# Altium schematic sheet Auxillary_Supply.SchDoc
size A3
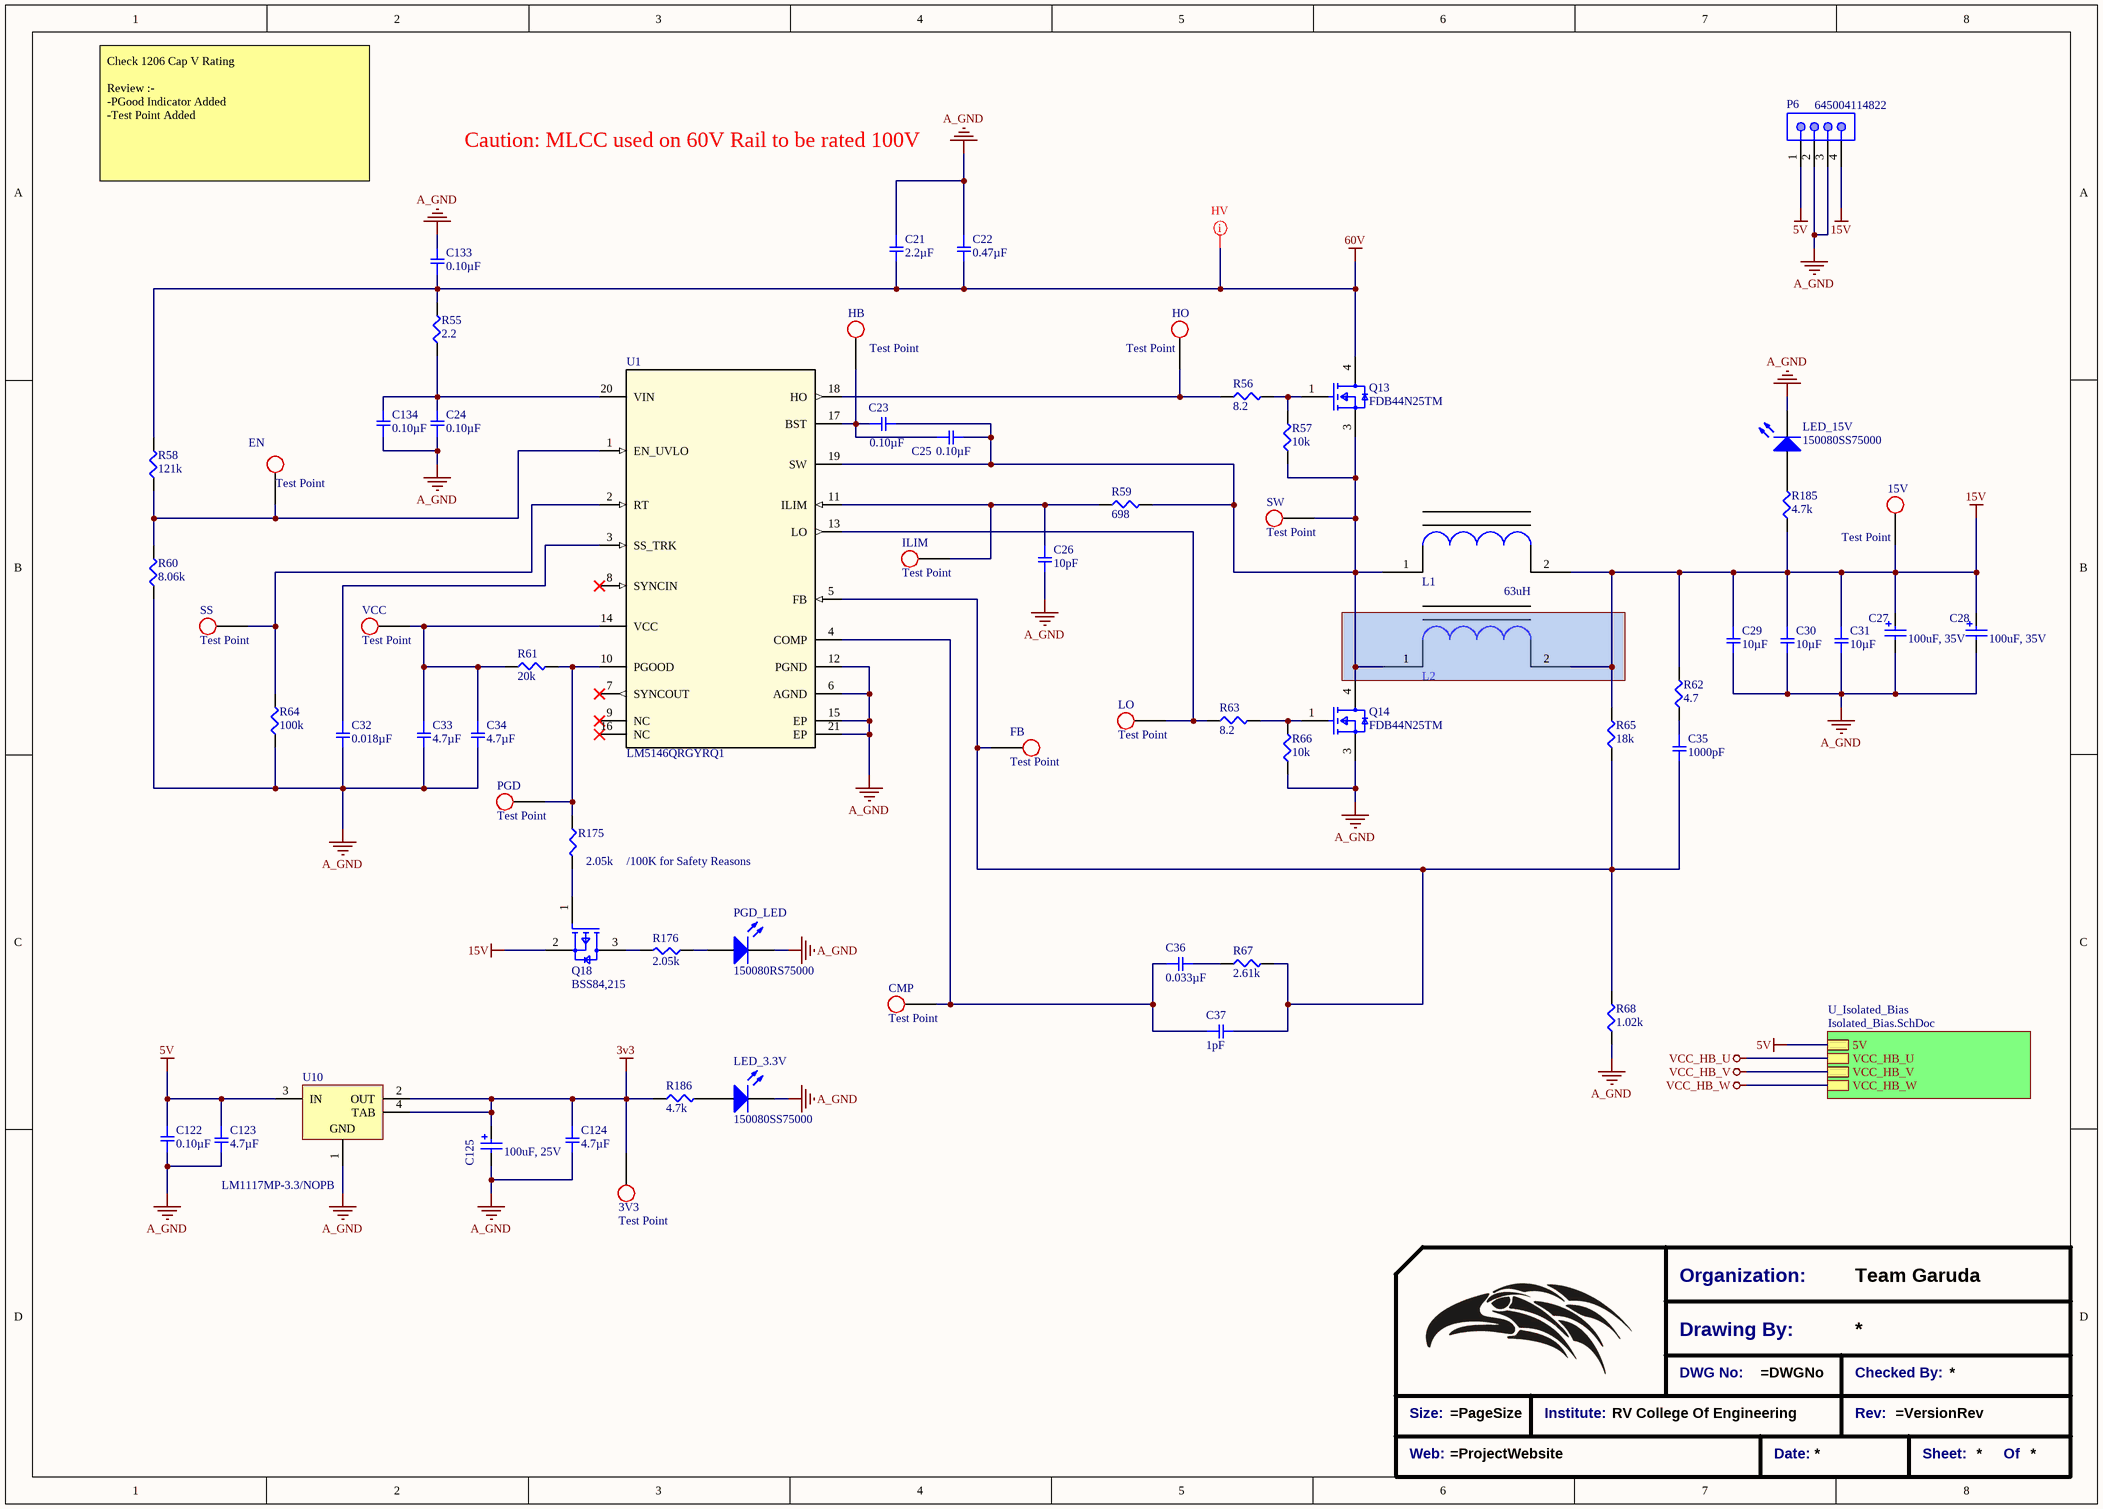
[diagram p0: Auxillary_Supply.SchDoc]

## Parts
3V3  Test Point  [Test_point_THT]  (no BOM)
15V  Test Point  [Test_point_THT]  (no BOM)
*?  Title_Block  (value not drawn)  (graphical)
C21  2.2µF  [SMD-1210C]
C22  0.47µF  [SMD-1206C]
C23  0.10µF  [SMD-0805C]
C24  0.10µF  [SMD-0805C]
C25  0.10µF  [SMD-0805C]
C26  10pF  [SMD-0805C]
C27  100uF, 35V  [WCAP-ASLL_8x10.5]
C28  100uF, 35V  [WCAP-ASLL_8x10.5]
C29  10µF  [SMD-1210C]
C30  10µF  [SMD-1206C]
C31  10µF  [SMD-1206C]
C32  0.018µF  [SMD-0805C]
C33  4.7µF  [SMD-0805C]
C34  4.7µF  [SMD-0805C]
C35  1000pF  [SMD-0805C]
C36  0.033µF  [SMD-0805C]
C37  1pF  [SMD-0805C]
C122  0.10µF  [SMD-0805C]
C123  4.7µF  [SMD-0805C]
C124  4.7µF  [SMD-0805C]
C125  100uF, 25V  [WCAP-ASLU_8x6.5]
C133  0.10µF  [SMD-0805C]
C134  0.10µF  [SMD-0805C]
CMP  Test Point  [Test_point_THT]  (no BOM)
EN  Test Point  [Test_point_THT]  (no BOM)
FB  Test Point  [Test_point_THT]  (no BOM)
HB  Test Point  [Test_point_THT]  (no BOM)
HO  Test Point  [Test_point_SMD]  (no BOM)
ILIM  Test Point  [Test_point_THT]  (no BOM)
L1  value 63uH  [SRR1260]  (hidden comment: Inductor)
L2  Inductor  [Inductor 25mm]  (value not drawn)
LED_3.3V  150080SS75000  [0805_A]
LED_15V  150080SS75000  [0805_A]
LO  Test Point  [Test_point_SMD]  (no BOM)
P6  645004114822  [645004114822]
PGD  Test Point  [Test_point_THT]  (no BOM)
PGD_LED  150080RS75000  [0805_A]
Q13  FDB44N25TM  [FP-418AJ-MFG - HALF VIA]
Q14  FDB44N25TM  [FP-418AJ-MFG]
Q18  BSS84,215  [FP-SOT23-MFG]
R55  2.2  [SMD-0805-RES]
R56  8.2  [SMD-0805-RES]
R57  10k  [SMD-0805-RES]
R58  121k  [SMD-0805-RES]
R59  698  [SMD-0805-RES]
R60  8.06k  [SMD-0805-RES]
R61  20k  [SMD-0805-RES]
R62  4.7  [SMD-0805-RES]
R63  8.2  [SMD-0805-RES]
R64  100k  [SMD-0805-RES]
R65  18k  [SMD-0805-RES]
R66  10k  [SMD-0805-RES]
R67  2.61k  [SMD-0805-RES]
R68  1.02k  [SMD-0805-RES]
R175  2.05k  [SMD-0603-RES]
R176  2.05k  [SMD-0603-RES]
R185  4.7k  [SMD-0805-RES]
R186  4.7k  [SMD-0805-RES]
SS  Test Point  [Test_point_THT]  (no BOM)
SW  Test Point  [Test_point_THT]  (no BOM)
U1  LM5146QRGYRQ1  [QFN50P350X450X100_HS-21N]
U10  LM1117MP-3.3/NOPB  [DCY0004A_L]
VCC  Test Point  [Test_point_THT]  (no BOM)

## Sub-sheets
U_Isolated_Bias = Isolated_Bias.SchDoc: 5V, VCC_HB_U, VCC_HB_V, VCC_HB_W

## Nets
3v3: 3V3.1 C124.1 C125.2(P) R186.1 U10.2(OUT) U10.4(TAB)
5V: C122.2 C123.1 P6.1 U10.3(IN) ; sheet U_Isolated_Bias/5V
15V: 15V.1 C27.2(P) C28.2(P) C29.1 C30.1 C31.1 L1.2 L2.2 P6.4 Q18.2(S) R62.2 R65.2 R185.1
60V: C21.2 C22.2 C133.1 Q13.4(D) R55.2 R58.2
A_GND: C21.1 C22.1 C24.1 C26.2 C27.1(N) C28.1(N) C29.2 C30.2 C31.2 C32.2 C33.2 C34.2 C122.1 C123.2 C124.2 C125.1(N) C133.2 C134.1 LED_3.3V.1(K) LED_15V.1(K) P6.2 P6.3 PGD_LED.1(K) Q14.3(S) R60.1 R64.1 R66.1 R68.1 U1.6(AGND) U1.12(PGND) U1.15(EP) U1.21(EP) U10.1(GND)
VCC_HB_U: sheet U_Isolated_Bias/VCC_HB_U
VCC_HB_V: sheet U_Isolated_Bias/VCC_HB_V
VCC_HB_W: sheet U_Isolated_Bias/VCC_HB_W
NetC23_1: C23.1 C25.1 HB.1 U1.17(BST)
NetC23_2: C23.2 C25.2 L1.1 L2.1 Q13.3(S) Q14.4(D) R57.1 R59.2 SW.1 U1.19(SW)
NetC24_2: C24.2 C134.2 R55.1 U1.20(VIN)
NetC26_1: C26.1 ILIM.1 R59.1 U1.11(ILIM)
NetC32_1: C32.1 U1.3(SS_TRK)
NetC33_1: C33.1 C34.1 R61.1 U1.14(VCC) VCC.1
NetC35_1: C35.1 R62.1
NetC35_2: C35.2 C37.2 FB.1 R65.1 R67.2 R68.2 U1.5(FB)
NetC36_1: C36.1 C37.1 CMP.1 U1.4(COMP)
NetC36_2: C36.2 R67.1
NetEN_1: EN.1 R58.1 R60.2 U1.1(EN_UVLO)
NetHO_1: HO.1 R56.1 U1.18(HO)
NetLED_3.3V_2: LED_3.3V.2(A) R186.2
NetLED_15V_2: LED_15V.2(A) R185.2
NetLO_1: LO.1 R63.1 U1.13(LO)
NetPGD_1: PGD.1 R61.2 R175.1 U1.10(PGOOD)
NetPGD_LED_2: PGD_LED.2(A) R176.1
NetQ13_1: Q13.1(G) R56.2 R57.2
NetQ14_1: Q14.1(G) R63.2 R66.2
NetQ18_1: Q18.1(G) R175.2
NetQ18_3: Q18.3(D) R176.2
NetR64_2: R64.2 SS.1 U1.2(RT)

Not connected (* = marked no-connect by the designer): U1 7(SYNCOUT)* 8(SYNCIN)* 9(NC)* 16(NC)*

## Layout directives
net class HV; rule Clearance Constraint [Generic clearance = 30mil, and 31 value(s) for objects]: 60V

## Notes on the sheet
- Check 1206 Cap V Rating
  Review :-
  -PGood Indicator Added
  -Test Point Added
- Caution: MLCC used on 60V Rail to be rated 100V
- /100K for Safety Reasons
- (in symbol Title_Block) Organization:; Team Garuda; Drawing By:; DWG No:; Checked By:; Size:; Institute:; RV College Of Engineering; Rev:; Web:; Date:; Sheet:; Of

## Library data of the parts
*? = Title_Block: Standard Title Block
C21 = GCJ32DR72A225KA01L: CAP CER 2.2UF 100V X7R 1210; Manufacturer: Murata Electronics North America; Factory Stock: 0; Unit Price (USD): 1.5; Minimum Quantity: 1; Tolerance: ±10%; Datasheets: http://www.murata.com/~/media/webrenewal/support/library/catalog/products/capacitor/mlcc/c03e.ashx; Image: //media.digikey.com/Renders/Murata%20Renders/1210-32R.jpg; Digi-Key Part Number: 490-5840-1-ND; Part Number: GCJ32DR72A225KA01L; Quantity Available: 84171; @ qty: 0; Packaging: Cut Tape (CT); Series: GCJ; Part Status: Active; Value: 2.2µF; Voltage: 100V; Temperature Coefficient: X7R; Operating Temperature: -55°C ~ 125°C; Features: Soft Termination; Ratings: AEC-Q200; Applications: Automotive, Boardflex Sensitive; Failure Rate: Surface Mount, MLCC; Mounting Type: 1210 (3225 Metric); Package / Case: 0.126" L x 0.098" W (3.20mm x 2.50mm); Size / Dimension: -; Height - Seated (Max): 0.079" (2.00mm); Thickness (Max): -; Lead Spacing: -
C22 = GRM31MR72A474KA35L: CAP CER 0.47UF 100V X7R 1206; Manufacturer: Murata Electronics North America; Factory Stock: 0; Unit Price (USD): 0.7; Minimum Quantity: 1; Tolerance: ±10%; Datasheets: http://www.murata.com/~/media/webrenewal/support/library/catalog/products/capacitor/mlcc/c02e.pdf; Image: //media.digikey.com/Renders/Murata%20Renders/GR331BD72E473KW01L.jpg; Digi-Key Part Number: 490-11647-1-ND; Part Number: GRM31MR72A474KA35L; Quantity Available: 7752; @ qty: 0; Packaging: Cut Tape (CT); Series: GRM; Part Status: Active; Value: 0.47µF; Voltage: 100V; Temperature Coefficient: X7R; Operating Temperature: -55°C ~ 125°C; Features: -; Ratings: -; Applications: General Purpose; Mounting Type: Surface Mount, MLCC; Package / Case: 1206 (3216 Metric); Size / Dimension: 0.126" L x 0.063" W (3.20mm x 1.60mm); Height - Seated (Max): -; Thickness (Max): 0.049" (1.25mm); Lead Spacing: -; Lead Style: -
C23-C25 C122 C133 C134 = GRM21BR71E104KA01L: CAP CER 0.1UF 25V X7R 0805; Manufacturer: Murata Electronics North America; Factory Stock: 0; Unit Price (USD): 0.19; Minimum Quantity: 1; Tolerance: ±10%; Datasheets: http://www.murata.com/~/media/webrenewal/support/library/catalog/products/capacitor/mlcc/c02e.pdf; Image: //media.digikey.com/Renders/Murata%20Renders/0805%20(2012%20Metric)%20.85mm.jpg; Digi-Key Part Number: 490-1673-1-ND; Part Number: GRM21BR71E104KA01L; Quantity Available: 1009396; @ qty: 0; Packaging: Cut Tape (CT); Series: GRM; Part Status: Active; Value: 0.10µF; Voltage: 25V; Temperature Coefficient: X7R; Operating Temperature: -55°C ~ 125°C; Features: -; Ratings: -; Applications: General Purpose; Mounting Type: Surface Mount, MLCC; Package / Case: 0805 (2012 Metric); Size / Dimension: 0.079" L x 0.049" W (2.00mm x 1.25mm); Height - Seated (Max): -; Thickness (Max): 0.053" (1.35mm); Lead Spacing: -; Lead Style: -
C26 = GQM2195C2A100GB01D: CAP CER 10PF 100V NP0 0805; Manufacturer: Murata Electronics North America; Factory Stock: 0; Unit Price (USD): 0.91; Minimum Quantity: 1; Tolerance: ±2%; Temperature Coefficient: C0G, NP0; Datasheets: http://www.murata.com/~/media/webrenewal/support/library/catalog/products/capacitor/mlcc/c02e.pdf; Image: //media.digikey.com/Renders/Murata%20Renders/0805(GxM9).jpg; Digi-Key Part Number: 490-6098-1-ND; Part Number: GQM2195C2A100GB01D; Quantity Available: 3211; @ qty: 0; Packaging: Cut Tape (CT); Series: GQM; Part Status: Active; Value: 10pF; Voltage: 100V; Operating Temperature: -55°C ~ 125°C; Features: High Q, Low Loss; Ratings: -; Applications: RF, Microwave, High Frequency; Mounting Type: Surface Mount, MLCC; Package / Case: 0805 (2012 Metric); Size / Dimension: 0.079" L x 0.049" W (2.00mm x 1.25mm); Height - Seated (Max): -; Thickness (Max): 0.037" (0.95mm); Lead Spacing: -; Lead Style: -
C27 C28 = 865060553006: WCAP-ASLL SMT Aluminum Electrolytic Capacitors, D8mm x L10.5mm, 100uF, +/-20%, 35VDC; Dissipation Factor: 14%; Endurance: 5000h; Leakage Current: 35uA; Ripple Current max.: 450mA; Technical Reference: ASEE105101M035DVCTEE000; ComponentLink1Description: Manufacturer; ComponentLink1URL: http://www.we-online.de; ComponentLink2Description: Datasheet; ComponentLink2URL: https://katalog.we-online.com/pbs/datasheet/865060553006.pdf; Length: 10.5mm; Mounting Technology: SMT; Operating Temperature: -55 to +105degC; Packaging: Tape and Reel; Published Date: August 2019; Capacitance: 100uF; Diameter: 8mm; Part Number: 865060553006; Publisher: Wurth Elektronik; Capacitance Tolerance: +/-20%; Rated Voltage: 35VDC
C29 = GRM32DR61E106MA12L: CAP CER 10UF 25V X5R 1210; Manufacturer: Murata Electronics North America; Factory Stock: 0; Unit Price (USD): 0.5; Minimum Quantity: 1; Tolerance: ±20%; Datasheets: http://www.murata.com/~/media/webrenewal/support/library/catalog/products/capacitor/mlcc/c02e.pdf; Image: //media.digikey.com/Renders/Murata%20Renders/1210-3225-16.jpg; Digi-Key Part Number: 490-6530-1-ND; Part Number: GRM32DR61E106MA12L; Quantity Available: 29124; @ qty: 0; Packaging: Cut Tape (CT); Series: GRM; Part Status: Active; Value: 10µF; Voltage: 25V; Temperature Coefficient: X5R; Operating Temperature: -55°C ~ 85°C; Features: -; Ratings: -; Applications: General Purpose; Failure Rate: Surface Mount, MLCC; Mounting Type: 1210 (3225 Metric); Package / Case: 0.126" L x 0.098" W (3.20mm x 2.50mm); Size / Dimension: -; Height - Seated (Max): 0.087" (2.20mm); Thickness (Max): -; Lead Spacing: -
C30 C31 = GRM31CR71E106MA12L: CAP CER 10UF 25V X7R 1206; Manufacturer: Murata Electronics North America; Factory Stock: 0; Unit Price (USD): 0.25; Minimum Quantity: 1; Tolerance: ±20%; Datasheets: http://www.murata.com/~/media/webrenewal/support/library/catalog/products/capacitor/mlcc/c02e.pdf; Image: //media.digikey.com/Renders/Murata%20Renders/GR331BD72E473KW01L.jpg; Digi-Key Part Number: 490-6519-1-ND; Part Number: GRM31CR71E106MA12L; Quantity Available: 42201; @ qty: 0; Packaging: Cut Tape (CT); Series: GRM; Part Status: Active; Value: 10µF; Voltage: 25V; Temperature Coefficient: X7R; Operating Temperature: -55°C ~ 125°C; Features: -; Ratings: -; Applications: General Purpose; Mounting Type: Surface Mount, MLCC; Package / Case: 1206 (3216 Metric); Size / Dimension: 0.126" L x 0.063" W (3.20mm x 1.60mm); Height - Seated (Max): -; Thickness (Max): 0.071" (1.80mm); Lead Spacing: -; Lead Style: -
C32 = GRM21BR72A183KA01L: CAP CER 0.018UF 100V X7R 0805; Manufacturer: Murata Electronics North America; Factory Stock: 0; Unit Price (USD): 0.21; Minimum Quantity: 1; Tolerance: ±10%; Datasheets: http://www.murata.com/~/media/webrenewal/support/library/catalog/products/capacitor/mlcc/c02e.pdf; Image: //media.digikey.com/Renders/Murata%20Renders/0805%20(2012%20Metric)%20.85mm.jpg; Digi-Key Part Number: 490-1657-1-ND; Part Number: GRM21BR72A183KA01L; Quantity Available: 8214; @ qty: 0; Packaging: Cut Tape (CT); Series: GRM; Part Status: Active; Value: 0.018µF; Voltage: 100V; Temperature Coefficient: X7R; Operating Temperature: -55°C ~ 125°C; Features: -; Ratings: -; Applications: General Purpose; Mounting Type: Surface Mount, MLCC; Package / Case: 0805 (2012 Metric); Size / Dimension: 0.079" L x 0.049" W (2.00mm x 1.25mm); Height - Seated (Max): -; Thickness (Max): 0.053" (1.35mm); Lead Spacing: -; Lead Style: -
C33 C34 C123 C124 = GCJ21BR71C475KA01L: CAP CER 4.7UF 16V X7R 0805; Manufacturer: Murata Electronics North America; Factory Stock: 0; Unit Price (USD): 0.44; Minimum Quantity: 1; Tolerance: ±10%; Datasheets: http://www.murata.com/~/media/webrenewal/support/library/catalog/products/capacitor/mlcc/c03e.ashx; Image: //media.digikey.com/Renders/Murata%20Renders/0805%20(2012%20Metric)%20.85mm.jpg; Digi-Key Part Number: 490-10557-1-ND; Part Number: GCJ21BR71C475KA01L; Quantity Available: 53217; @ qty: 0; Packaging: Cut Tape (CT); Series: GCJ; Part Status: Active; Value: 4.7µF; Voltage: 16V; Temperature Coefficient: X7R; Operating Temperature: -55°C ~ 125°C; Features: Soft Termination; Ratings: AEC-Q200; Applications: Automotive, Boardflex Sensitive; Mounting Type: Surface Mount, MLCC; Package / Case: 0805 (2012 Metric); Size / Dimension: 0.079" L x 0.049" W (2.00mm x 1.25mm); Height - Seated (Max): -; Thickness (Max): 0.057" (1.45mm); Lead Spacing: -; Lead Style: -
C35 = GCJ216R71H102KA01D: CAP CER 1000PF 50V X7R 0805; Manufacturer: Murata Electronics North America; Factory Stock: 0; Unit Price (USD): 0.24; Minimum Quantity: 1; Tolerance: ±10%; Datasheets: http://www.murata.com/~/media/webrenewal/support/library/catalog/products/capacitor/mlcc/c03e.ashx; Image: //media.digikey.com/Renders/Murata%20Renders/0805%20(2012%20Metric)%20.85mm.jpg; Digi-Key Part Number: 490-5813-1-ND; Part Number: GCJ216R71H102KA01D; Quantity Available: 3433; @ qty: 0; Packaging: Cut Tape (CT); Series: GCJ; Part Status: Active; Value: 1000pF; Voltage: 50V; Temperature Coefficient: X7R; Operating Temperature: -55°C ~ 125°C; Features: Soft Termination; Ratings: AEC-Q200; Applications: Automotive, Boardflex Sensitive; Mounting Type: Surface Mount, MLCC; Package / Case: 0805 (2012 Metric); Size / Dimension: 0.079" L x 0.049" W (2.00mm x 1.25mm); Height - Seated (Max): -; Thickness (Max): 0.024" (0.60mm); Lead Spacing: -; Lead Style: -
C36 = GCJ219R71H333KA01D: CAP CER 0.033UF 50V X7R 0805; Manufacturer: Murata Electronics North America; Factory Stock: 0; Unit Price (USD): 0.29; Minimum Quantity: 1; Tolerance: ±10%; Datasheets: http://www.murata.com/~/media/webrenewal/support/library/catalog/products/capacitor/mlcc/c03e.ashx; Image: //media.digikey.com/Renders/Murata%20Renders/0805%20(2012%20Metric)%20.85mm.jpg; Digi-Key Part Number: 490-5846-1-ND; Part Number: GCJ219R71H333KA01D; Quantity Available: 2881; @ qty: 0; Packaging: Cut Tape (CT); Series: GCJ; Part Status: Active; Value: 0.033µF; Voltage: 50V; Temperature Coefficient: X7R; Operating Temperature: -55°C ~ 125°C; Features: Soft Termination; Ratings: AEC-Q200; Applications: Automotive, Boardflex Sensitive; Mounting Type: Surface Mount, MLCC; Package / Case: 0805 (2012 Metric); Size / Dimension: 0.079" L x 0.049" W (2.00mm x 1.25mm); Height - Seated (Max): -; Thickness (Max): 0.033" (0.85mm); Lead Spacing: -; Lead Style: -
C37 = GQM2195C2A1R0BB01D: CAP CER 1PF 100V NP0 0805; Manufacturer: Murata Electronics North America; Factory Stock: 0; Unit Price (USD): 0.82; Minimum Quantity: 1; Tolerance: ±0.1pF; Temperature Coefficient: C0G, NP0; Datasheets: http://www.murata.com/~/media/webrenewal/support/library/catalog/products/capacitor/mlcc/c02e.pdf; Image: //media.digikey.com/Renders/Murata%20Renders/0805(GxM9).jpg; Digi-Key Part Number: 490-6099-1-ND; Part Number: GQM2195C2A1R0BB01D; Quantity Available: 1739; @ qty: 0; Packaging: Cut Tape (CT); Series: GQM; Part Status: Active; Value: 1pF; Voltage: 100V; Operating Temperature: -55°C ~ 125°C; Features: High Q, Low Loss; Ratings: -; Applications: RF, Microwave, High Frequency; Mounting Type: Surface Mount, MLCC; Package / Case: 0805 (2012 Metric); Size / Dimension: 0.079" L x 0.049" W (2.00mm x 1.25mm); Height - Seated (Max): -; Thickness (Max): 0.037" (0.95mm); Lead Spacing: -; Lead Style: -
C125 = 865090449009: WCAP-ASLU Aluminium Electrolytic Capacitors, D8mm x L6.5mm, 100uF, +/-20%, 25VDC; Dissipation Factor: 16%; Leakage Current: 5uA; Endurance: 1000h; Technical Reference: ASBE065101M025DVCTBA000; Ripple Current max.: 110mA; ComponentLink1Description: Manufacturer; ComponentLink1URL: http://www.we-online.de; ComponentLink2Description: Datasheet; ComponentLink2URL: https://katalog.we-online.com/pbs/datasheet/865090449009.pdf; Mounting Technology: SMD; Operating Temperature: -40 to +85degC; Packaging: Tape and Reel; Part Number: 865090449009; Publisher: Wurth Elektronik; Capacitance: 100uF; Diameter: 8mm; Length: 6.5mm; Published Date: August 2019; Rated Voltage: 25VDC; Capacitance Tolerance: +/-20%
LED_3.3V LED_15V = 150080SS75000: SMD mono-color Chip LED, WL-SMCW, Super Red; PackageReference: 0805_A; Color: Super Red; PartNumber: 150080SS75000; ComponentLink1Description: Manufacturer URL; ComponentLink1URL: http://www.we-online.com; ComponentLink2Description: Datasheet; ComponentLink2URL: http://katalog.we-online.com/led/datasheet/150080SS75000.pdf
P6 = 645004114822: WR-WTB THT Male Vertical Locking Header, pitch 3.96mm, 4p; Pin Number: 4; Contact Resistance: 20mOhm; Rated Current: 7A; Withstanding Voltage: 1500VAC; Working Voltage: 250VAC; ComponentLink1Description: Manufacturer; ComponentLink1URL: http://www.we-online.de; ComponentLink2Description: Datasheet; ComponentLink2URL: https://www.we-online.com/catalog/datasheet/645004114822.pdf; Pitch: 3.96mm; Published Date: January 2020; Publisher: Wurth Elektronik; Mounting Technology: THT; Packaging: Bag; Operating Temperature: -40 to +105degC; Part Number: 645004114822; Gender: Male; Type: Vertical
PGD_LED = 150080RS75000: SMD mono-color Chip LED, WL-SMCW, Red; PackageReference: 0805_A; Color: Red; PartNumber: 150080RS75000; ComponentLink1Description: Manufacturer URL; ComponentLink1URL: http://www.we-online.com; ComponentLink2Description: Datasheet; ComponentLink2URL: http://katalog.we-online.com/led/datasheet/150080RS75000.pdf
Q13 Q14 = CMP-07173-000078-1: MOSFET N-CH 250V 44A D2PAK; Manufacturer: ON Semi; Number Of Channels: 1; Turn Off Delay Time: 85ns; Power Dissipation: 307W; Turn On Delay Time: 55ns; Gate Charge At Vgs: 47nC @ 10V; Gate To Source Voltage: 30V; Reverse Recovery Time: 195ns; Threshold Vgs Max: 5V; Drain To Source Resistance: 0.058Ω; Max Junction Temp: +150°C; Reverse Recovery Charge: 1800nC; Input Capacitace At Vds: 2210pF @ 25V; Standoff Height: 0mm; Threshold Vgs Min: 3V; Transconductance: 32S; Depletion Mode: False; Rthja Max: 62.5°C/W; Pulse Drain Current: 176A; Max Forward Diode Voltage: 1.4V; Octopart: https://octopart.com/fdb44n25tm-on+semiconductor-84325676; Lead Free: Yes; Drain To Source Breakdown Voltage: 250V; RoHS: TRUE; Device Class L2: Transistors; ComponentLink2URL: https://www.onsemi.com/pub/Collateral/FDB44N25-D.pdf; Digikey Description: MOSFET N-CH 250V 44A D2PAK; Device Class L1: Discrete Semiconductors; Continuous Drain Current: 44A; Temperature: -55°C to +150°C; Footprint Url: https://www.onsemi.com/pub/Collateral/418AJ.PDF; Temperature Range High: +150°C; Automotive: No; Package: 418AJ; Category: Trans; ComponentLink2Description: Datasheet; Height: 4.83mm; Number Of N Channels: 1; Manufacturer Part Number: FDB44N25TM; Drain To Source Voltage: 250V; Temperature Range Low: -55°C; Device Class L3: MOSFETs; Mouser Description: ON SEMICONDUCTOR - FDB44N25TM - MOSFET, N-CH, 250V, 44A, TO-263AB-2; Technology: Si
Q18 = CMP-14409-000006-1: MOSFET P-CH 50V 130MA SOT-23; Manufacturer: Nexperia USA Inc.; Drain To Source Breakdown Voltage: -50V; Max Junction Temp: +150°C; Threshold Vgs Min: -0.8V; Turn On Delay Time: 3ns; Power Dissipation: 250mW; Turn Off Delay Time: 7ns; Gate To Source Voltage: 20V; Number Of Channels: 1; Input Capacitace At Vds: 25pF @ -25V; Threshold Vgs Max: -2V; Continuous Drain Current: -130mA; Depletion Mode: False; Drain To Source Resistance: 6Ω; Rthja Max: 500K/W; Octopart: https://octopart.com/bss84%2C215-nexperia-78739375; Ipc Land Pattern Name: SOT95P230X100-3; Drain To Source Voltage: -50V; Lead Free: Yes; Temperature Range High: +150°C; Automotive: No; Device Class L2: Transistors; Manufacturer Part Number: BSS84,215; Package: SOT23; ComponentLink2URL: https://assets.nexperia.com/documents/data-sheet/BSS84.pdf; Category: Trans; RoHS: TRUE; Temperature Range Low: -65°C; ComponentLink2Description: Datasheet; Device Class L1: Discrete Semiconductors; Number Of P Channels: 1; Device Class L3: MOSFETs; Height: 1.1mm; Digikey Description: MOSFET P-CH 50V 130MA SOT-23; Temperature: -65°C to +150°C; Footprint Url: https://assets.nexperia.com/documents/outline-drawing/SOT23.pdf
R55 = ERJ-6BQF2R2V: RES SMD 2.2 OHM 1% 1/3W 0805; Manufacturer: Panasonic Electronic Components; Factory Stock: 0; Unit Price (USD): 0.05834; @ qty: 1500; Minimum Quantity: 1; Power (Watts): 0.333W, 1/3W; Temperature Coefficient: ±200ppm/°C; Part Number: ERJ-6BQF2R2V; Datasheets: https://industrial.panasonic.com/cdbs/www-data/pdf/RDA0000/AOA0000C239.pdf; Image: //media.digikey.com/Renders/Panasonic%20Renders/ERJ-0805%20Pkg.jpg; Digi-Key Part Number: P17504CT-ND; Quantity Available: 8127; Packaging: Cut Tape (CT); Series: ERJ; Part Status: Active; Value: 2.2; Tolerance: ±1%; Composition: Thick Film; Features: Automotive AEC-Q200, Current Sense; Operating Temperature: -55°C ~ 125°C; Package / Case: 0805 (2012 Metric); Supplier Device Package: 0805; Size / Dimension: 0.079" L x 0.049" W (2.00mm x 1.25mm); Height - Seated (Max): 0.028" (0.70mm); Number of Terminations: 2; Failure Rate: -
R56 R63 = ERJ-6BQF8R2V: RES SMD 8.2 OHM 1% 1/3W 0805; Manufacturer: Panasonic Electronic Components; Factory Stock: 0; Unit Price (USD): 0.05834; @ qty: 1500; Minimum Quantity: 1; Power (Watts): 0.333W, 1/3W; Temperature Coefficient: ±200ppm/°C; Part Number: ERJ-6BQF8R2V; Datasheets: https://industrial.panasonic.com/cdbs/www-data/pdf/RDA0000/AOA0000C239.pdf; Image: //media.digikey.com/Renders/Panasonic%20Renders/ERJ-0805%20Pkg.jpg; Digi-Key Part Number: P17514CT-ND; Quantity Available: 6710; Packaging: Cut Tape (CT); Series: ERJ; Part Status: Active; Value: 8.2; Tolerance: ±1%; Composition: Thick Film; Features: Automotive AEC-Q200, Current Sense; Operating Temperature: -55°C ~ 125°C; Package / Case: 0805 (2012 Metric); Supplier Device Package: 0805; Size / Dimension: 0.079" L x 0.049" W (2.00mm x 1.25mm); Height - Seated (Max): 0.028" (0.70mm); Number of Terminations: 2; Failure Rate: -
R57 R66 = ERJ-6ENF1002V: RES SMD 10K OHM 1% 1/8W 0805; Manufacturer: Panasonic Electronic Components; Factory Stock: 0; Unit Price (USD): 0.00729; @ qty: 1500; Minimum Quantity: 1; Power (Watts): 0.125W, 1/8W; Temperature Coefficient: ±100ppm/°C; Part Number: ERJ-6ENF1002V; Datasheets: http://industrial.panasonic.com/www-cgi/jvcr13pz.cgi?E+PZ+3+AOA0002+ERJ6ENF1002V+7+WW; Image: //media.digikey.com/Renders/Panasonic%20Renders/ERJ-0805%20Pkg.jpg; Digi-Key Part Number: P10.0KCCT-ND; Quantity Available: 3985614; Packaging: Cut Tape (CT); Series: ERJ; Part Status: Active; Value: 10k; Tolerance: ±1%; Composition: Thick Film; Features: Automotive AEC-Q200; Operating Temperature: -55°C ~ 155°C; Package / Case: 0805 (2012 Metric); Supplier Device Package: 0805; Size / Dimension: 0.079" L x 0.049" W (2.00mm x 1.25mm); Height - Seated (Max): 0.028" (0.70mm); Number of Terminations: 2; Failure Rate: -
R58 = ERJ-6ENF1213V: RES SMD 121K OHM 1% 1/8W 0805; Manufacturer: Panasonic Electronic Components; Factory Stock: 0; Unit Price (USD): 0.00729; @ qty: 1500; Minimum Quantity: 1; Power (Watts): 0.125W, 1/8W; Temperature Coefficient: ±100ppm/°C; Part Number: ERJ-6ENF1213V; Datasheets: http://industrial.panasonic.com/www-cgi/jvcr13pz.cgi?E+PZ+3+AOA0002+ERJ6ENF1213V+7+WW; Image: //media.digikey.com/Renders/Panasonic%20Renders/ERJ-0805%20Pkg.jpg; Digi-Key Part Number: P121KCCT-ND; Quantity Available: 49210; Packaging: Cut Tape (CT); Series: ERJ; Part Status: Active; Value: 121k; Tolerance: ±1%; Composition: Thick Film; Features: Automotive AEC-Q200; Operating Temperature: -55°C ~ 155°C; Package / Case: 0805 (2012 Metric); Supplier Device Package: 0805; Size / Dimension: 0.079" L x 0.049" W (2.00mm x 1.25mm); Height - Seated (Max): 0.028" (0.70mm); Number of Terminations: 2; Failure Rate: -
R59 = ERJ-6ENF6980V: RES SMD 698 OHM 1% 1/8W 0805; Manufacturer: Panasonic Electronic Components; Factory Stock: 0; Unit Price (USD): 0.00729; @ qty: 1500; Minimum Quantity: 1; Power (Watts): 0.125W, 1/8W; Temperature Coefficient: ±100ppm/°C; Part Number: ERJ-6ENF6980V; Datasheets: http://industrial.panasonic.com/www-cgi/jvcr13pz.cgi?E+PZ+3+AOA0002+ERJ6ENF6980V+7+WW; Image: //media.digikey.com/Renders/Panasonic%20Renders/ERJ-0805%20Pkg.jpg; Digi-Key Part Number: P698CCT-ND; Quantity Available: 22584; Packaging: Cut Tape (CT); Series: ERJ; Part Status: Active; Value: 698; Tolerance: ±1%; Composition: Thick Film; Features: Automotive AEC-Q200; Operating Temperature: -55°C ~ 155°C; Package / Case: 0805 (2012 Metric); Supplier Device Package: 0805; Size / Dimension: 0.079" L x 0.049" W (2.00mm x 1.25mm); Height - Seated (Max): 0.028" (0.70mm); Number of Terminations: 2; Failure Rate: -
R60 = ERJ-6ENF8061V: RES SMD 8.06K OHM 1% 1/8W 0805; Manufacturer: Panasonic Electronic Components; Factory Stock: 0; Unit Price (USD): 0.00729; @ qty: 1500; Minimum Quantity: 1; Power (Watts): 0.125W, 1/8W; Temperature Coefficient: ±100ppm/°C; Part Number: ERJ-6ENF8061V; Datasheets: http://industrial.panasonic.com/www-cgi/jvcr13pz.cgi?E+PZ+3+AOA0002+ERJ6ENF8061V+7+WW; Image: //media.digikey.com/Renders/Panasonic%20Renders/ERJ-0805%20Pkg.jpg; Digi-Key Part Number: P8.06KCCT-ND; Quantity Available: 36710; Packaging: Cut Tape (CT); Series: ERJ; Part Status: Active; Value: 8.06k; Tolerance: ±1%; Composition: Thick Film; Features: Automotive AEC-Q200; Operating Temperature: -55°C ~ 155°C; Package / Case: 0805 (2012 Metric); Supplier Device Package: 0805; Size / Dimension: 0.079" L x 0.049" W (2.00mm x 1.25mm); Height - Seated (Max): 0.028" (0.70mm); Number of Terminations: 2; Failure Rate: -
R61 = ERJ-6ENF2002V: RES SMD 20K OHM 1% 1/8W 0805; Manufacturer: Panasonic Electronic Components; Factory Stock: 0; Unit Price (USD): 0.00729; @ qty: 1500; Minimum Quantity: 1; Power (Watts): 0.125W, 1/8W; Temperature Coefficient: ±100ppm/°C; Part Number: ERJ-6ENF2002V; Datasheets: http://industrial.panasonic.com/www-cgi/jvcr13pz.cgi?E+PZ+3+AOA0002+ERJ6ENF2002V+7+WW; Image: //media.digikey.com/Renders/Panasonic%20Renders/ERJ-0805%20Pkg.jpg; Digi-Key Part Number: P20.0KCCT-ND; Quantity Available: 208257; Packaging: Cut Tape (CT); Series: ERJ; Part Status: Active; Value: 20k; Tolerance: ±1%; Composition: Thick Film; Features: Automotive AEC-Q200; Operating Temperature: -55°C ~ 155°C; Package / Case: 0805 (2012 Metric); Supplier Device Package: 0805; Size / Dimension: 0.079" L x 0.049" W (2.00mm x 1.25mm); Height - Seated (Max): 0.028" (0.70mm); Number of Terminations: 2; Failure Rate: -
R62 = ERJ-6BQF4R7V: RES SMD 4.7 OHM 1% 1/3W 0805; Manufacturer: Panasonic Electronic Components; Factory Stock: 0; Unit Price (USD): 0.07013; @ qty: 1500; Minimum Quantity: 1; Power (Watts): 0.333W, 1/3W; Temperature Coefficient: ±200ppm/°C; Part Number: ERJ-6BQF4R7V; Datasheets: https://industrial.panasonic.com/cdbs/www-data/pdf/RDA0000/AOA0000C239.pdf; Image: //media.digikey.com/Renders/Panasonic%20Renders/ERJ-0805%20Pkg.jpg; Digi-Key Part Number: P15995CT-ND; Quantity Available: 9150; Packaging: Cut Tape (CT); Series: ERJ; Part Status: Active; Value: 4.7; Tolerance: ±1%; Composition: Thick Film; Features: Automotive AEC-Q200, Current Sense; Operating Temperature: -55°C ~ 125°C; Package / Case: 0805 (2012 Metric); Supplier Device Package: 0805; Size / Dimension: 0.079" L x 0.049" W (2.00mm x 1.25mm); Height - Seated (Max): 0.028" (0.70mm); Number of Terminations: 2; Failure Rate: -
R64 = ERJ-6ENF1003V: RES SMD 100K OHM 1% 1/8W 0805; Manufacturer: Panasonic Electronic Components; Factory Stock: 0; Unit Price (USD): 0.00729; @ qty: 1500; Minimum Quantity: 1; Power (Watts): 0.125W, 1/8W; Temperature Coefficient: ±100ppm/°C; Part Number: ERJ-6ENF1003V; Datasheets: http://industrial.panasonic.com/www-cgi/jvcr13pz.cgi?E+PZ+3+AOA0002+ERJ6ENF1003V+7+WW; Image: //media.digikey.com/Renders/Panasonic%20Renders/ERJ-0805%20Pkg.jpg; Digi-Key Part Number: P100KCCT-ND; Quantity Available: 760677; Packaging: Cut Tape (CT); Series: ERJ; Part Status: Active; Value: 100k; Tolerance: ±1%; Composition: Thick Film; Features: Automotive AEC-Q200; Operating Temperature: -55°C ~ 155°C; Package / Case: 0805 (2012 Metric); Supplier Device Package: 0805; Size / Dimension: 0.079" L x 0.049" W (2.00mm x 1.25mm); Height - Seated (Max): 0.028" (0.70mm); Number of Terminations: 2; Failure Rate: -
R65 = ERJ-6ENF1802V: RES SMD 18K OHM 1% 1/8W 0805; Manufacturer: Panasonic Electronic Components; Factory Stock: 0; Unit Price (USD): 0.00729; @ qty: 1500; Minimum Quantity: 1; Power (Watts): 0.125W, 1/8W; Temperature Coefficient: ±100ppm/°C; Part Number: ERJ-6ENF1802V; Datasheets: http://industrial.panasonic.com/www-cgi/jvcr13pz.cgi?E+PZ+3+AOA0002+ERJ6ENF1802V+7+WW; Image: //media.digikey.com/Renders/Panasonic%20Renders/ERJ-0805%20Pkg.jpg; Digi-Key Part Number: P18.0KCCT-ND; Quantity Available: 28787; Packaging: Cut Tape (CT); Series: ERJ; Part Status: Active; Value: 18k; Tolerance: ±1%; Composition: Thick Film; Features: Automotive AEC-Q200; Operating Temperature: -55°C ~ 155°C; Package / Case: 0805 (2012 Metric); Supplier Device Package: 0805; Size / Dimension: 0.079" L x 0.049" W (2.00mm x 1.25mm); Height - Seated (Max): 0.028" (0.70mm); Number of Terminations: 2; Failure Rate: -
R67 = ERJ-6ENF2611V: RES SMD 2.61K OHM 1% 1/8W 0805; Manufacturer: Panasonic Electronic Components; Factory Stock: 0; Unit Price (USD): 0.00729; @ qty: 1500; Minimum Quantity: 1; Power (Watts): 0.125W, 1/8W; Temperature Coefficient: ±100ppm/°C; Part Number: ERJ-6ENF2611V; Datasheets: http://industrial.panasonic.com/www-cgi/jvcr13pz.cgi?E+PZ+3+AOA0002+ERJ6ENF2611V+7+WW; Image: //media.digikey.com/Renders/Panasonic%20Renders/ERJ-0805%20Pkg.jpg; Digi-Key Part Number: P2.61KCCT-ND; Quantity Available: 42251; Packaging: Cut Tape (CT); Series: ERJ; Part Status: Active; Value: 2.61k; Tolerance: ±1%; Composition: Thick Film; Features: Automotive AEC-Q200; Operating Temperature: -55°C ~ 155°C; Package / Case: 0805 (2012 Metric); Supplier Device Package: 0805; Size / Dimension: 0.079" L x 0.049" W (2.00mm x 1.25mm); Height - Seated (Max): 0.028" (0.70mm); Number of Terminations: 2; Failure Rate: -
R68 = ERJ-6ENF1021V: RES SMD 1.02K OHM 1% 1/8W 0805; Manufacturer: Panasonic Electronic Components; Factory Stock: 0; Unit Price (USD): 0.00729; @ qty: 1500; Minimum Quantity: 1; Power (Watts): 0.125W, 1/8W; Temperature Coefficient: ±100ppm/°C; Part Number: ERJ-6ENF1021V; Datasheets: http://industrial.panasonic.com/www-cgi/jvcr13pz.cgi?E+PZ+3+AOA0002+ERJ6ENF1021V+7+WW; Image: //media.digikey.com/Renders/Panasonic%20Renders/ERJ-0805%20Pkg.jpg; Digi-Key Part Number: P1.02KCCT-ND; Quantity Available: 41456; Packaging: Cut Tape (CT); Series: ERJ; Part Status: Active; Value: 1.02k; Tolerance: ±1%; Composition: Thick Film; Features: Automotive AEC-Q200; Operating Temperature: -55°C ~ 155°C; Package / Case: 0805 (2012 Metric); Supplier Device Package: 0805; Size / Dimension: 0.079" L x 0.049" W (2.00mm x 1.25mm); Height - Seated (Max): 0.028" (0.70mm); Number of Terminations: 2; Failure Rate: -
R175 R176 = ERJ-3EKF2051V: RES SMD 2.05K OHM 1% 1/10W 0603; Manufacturer: Panasonic Electronic Components; Factory Stock: 0; Unit Price (USD): 0.00379; @ qty: 1500; Minimum Quantity: 1; Power (Watts): 0.1W, 1/10W; Temperature Coefficient: ±100ppm/°C; Part Number: ERJ-3EKF2051V; Datasheets: http://industrial.panasonic.com/www-cgi/jvcr13pz.cgi?E+PZ+3+AOA0002+ERJ3EKF2051V+7+WW; Image: //media.digikey.com/Photos/Panasonic%20Photos/MFG_ERJ-P6W%20Series.jpg; Digi-Key Part Number: P2.05KHCT-ND; Quantity Available: 48175; Packaging: Cut Tape (CT); Series: ERJ; Part Status: Active; Value: 2.05k; Tolerance: ±1%; Composition: Thick Film; Features: Automotive AEC-Q200; Operating Temperature: -55°C ~ 155°C; Package / Case: 0603 (1608 Metric); Supplier Device Package: 0603; Size / Dimension: 0.063" L x 0.031" W (1.60mm x 0.80mm); Height - Seated (Max): 0.022" (0.55mm); Number of Terminations: 2; Failure Rate: -
R185 R186 = ERJ-6ENF4701V: RES SMD 4.7K OHM 1% 1/8W 0805; Manufacturer: Panasonic Electronic Components; Factory Stock: 0; Unit Price (USD): 0.00729; @ qty: 1500; Minimum Quantity: 1; Power (Watts): 0.125W, 1/8W; Temperature Coefficient: ±100ppm/°C; Part Number: ERJ-6ENF4701V; Datasheets: http://industrial.panasonic.com/www-cgi/jvcr13pz.cgi?E+PZ+3+AOA0002+ERJ6ENF4701V+7+WW; Image: //media.digikey.com/Renders/Panasonic%20Renders/ERJ-0805%20Pkg.jpg; Digi-Key Part Number: P4.70KCCT-ND; Quantity Available: 312387; Packaging: Cut Tape (CT); Series: ERJ; Part Status: Active; Value: 4.7k; Tolerance: ±1%; Composition: Thick Film; Features: Automotive AEC-Q200; Operating Temperature: -55°C ~ 155°C; Package / Case: 0805 (2012 Metric); Supplier Device Package: 0805; Size / Dimension: 0.079" L x 0.049" W (2.00mm x 1.25mm); Height - Seated (Max): 0.028" (0.70mm); Number of Terminations: 2; Failure Rate: -
U1 = LM5146QRGYRQ1: Imported; Manufacturer: Texas Instruments; PartNumber: LM5146QRGYRQ1; RefDes: RefDes; Type: DEV; Value: Value; Manufacturer_Part_Number: LM5146QRGYRQ1; Manufacturer_Name: Texas Instruments
U10 = CMP-0062-01638-4: 800mA Low-Dropout Linear Regulator, 4-pin SOT-223, Pb-Free; Manufacturer: Texas Instruments; CompType: LDO IC; PackageTopMarking: XYTT*N05A; High-Reliability: Y; PowerWise: N; ComponentLink1URL: http://www.ti.com/general/docs/lit/getliterature.tsp?genericPartNumber=LM1117-N&fileType=pdf; PinCount: 4; PackageDescription: Molded SOT-223, 6.50 x 3.56 x 1.6mm Body, 4 Lead, 2.3mm Pitch; Code_IPC: SOT223-4; PartNumber: LM1117MP-3.3/NOPB; Code_JEDEC: TO-261-AA; RoHS: Y; PackageReference: DCY0004A; ComponentLink1Description: Datasheet URL